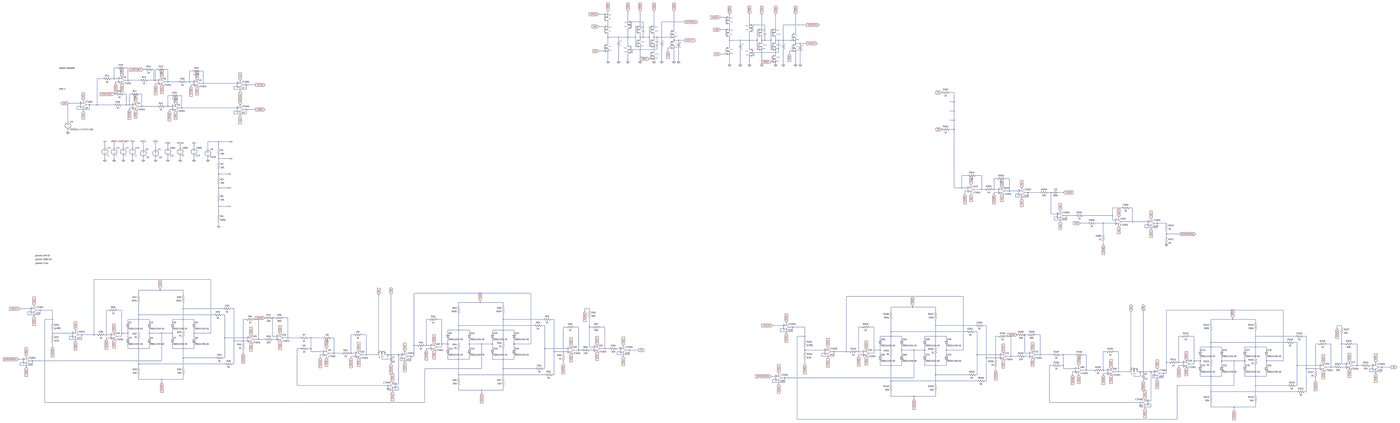
[diagram p0: schematic OZ_8_bounded_curves.asc, whole sheet]
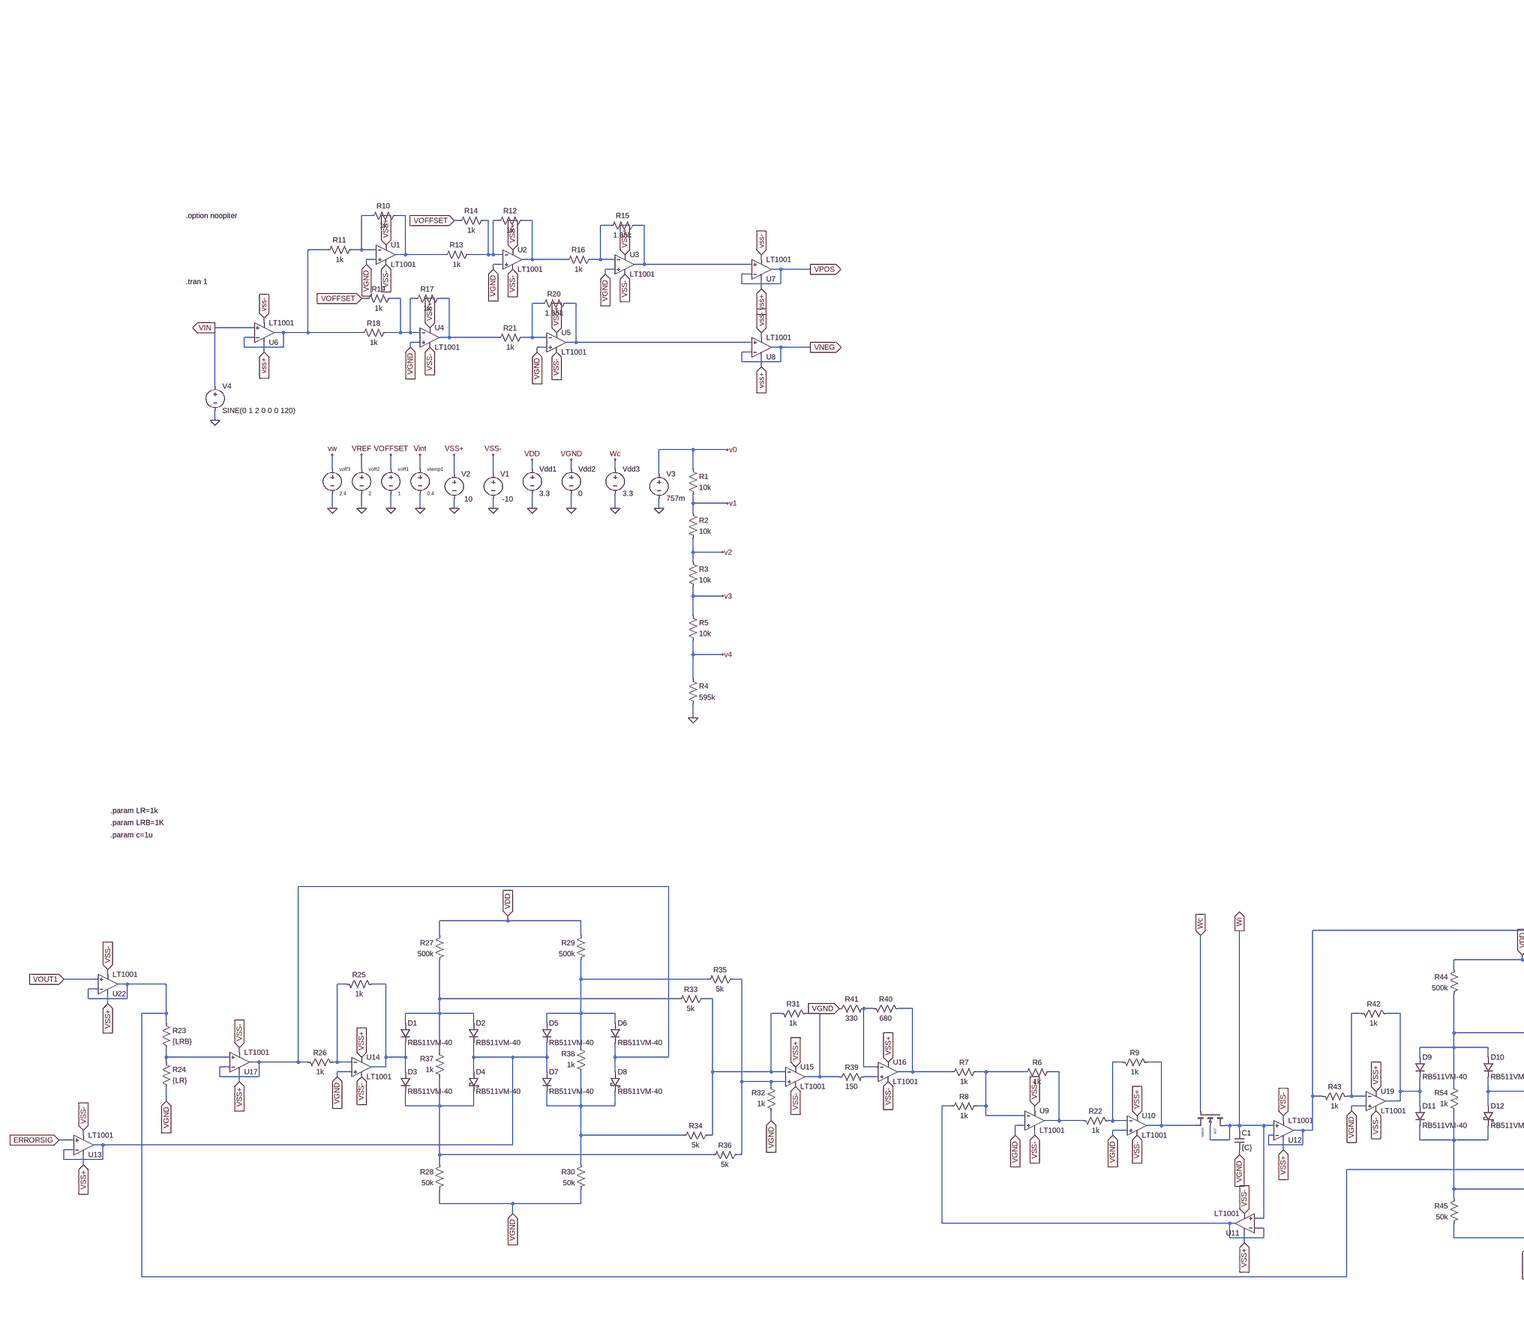
[diagram p1: schematic OZ_8_bounded_curves.asc, part, row 1 of 1, column 1 of 3]
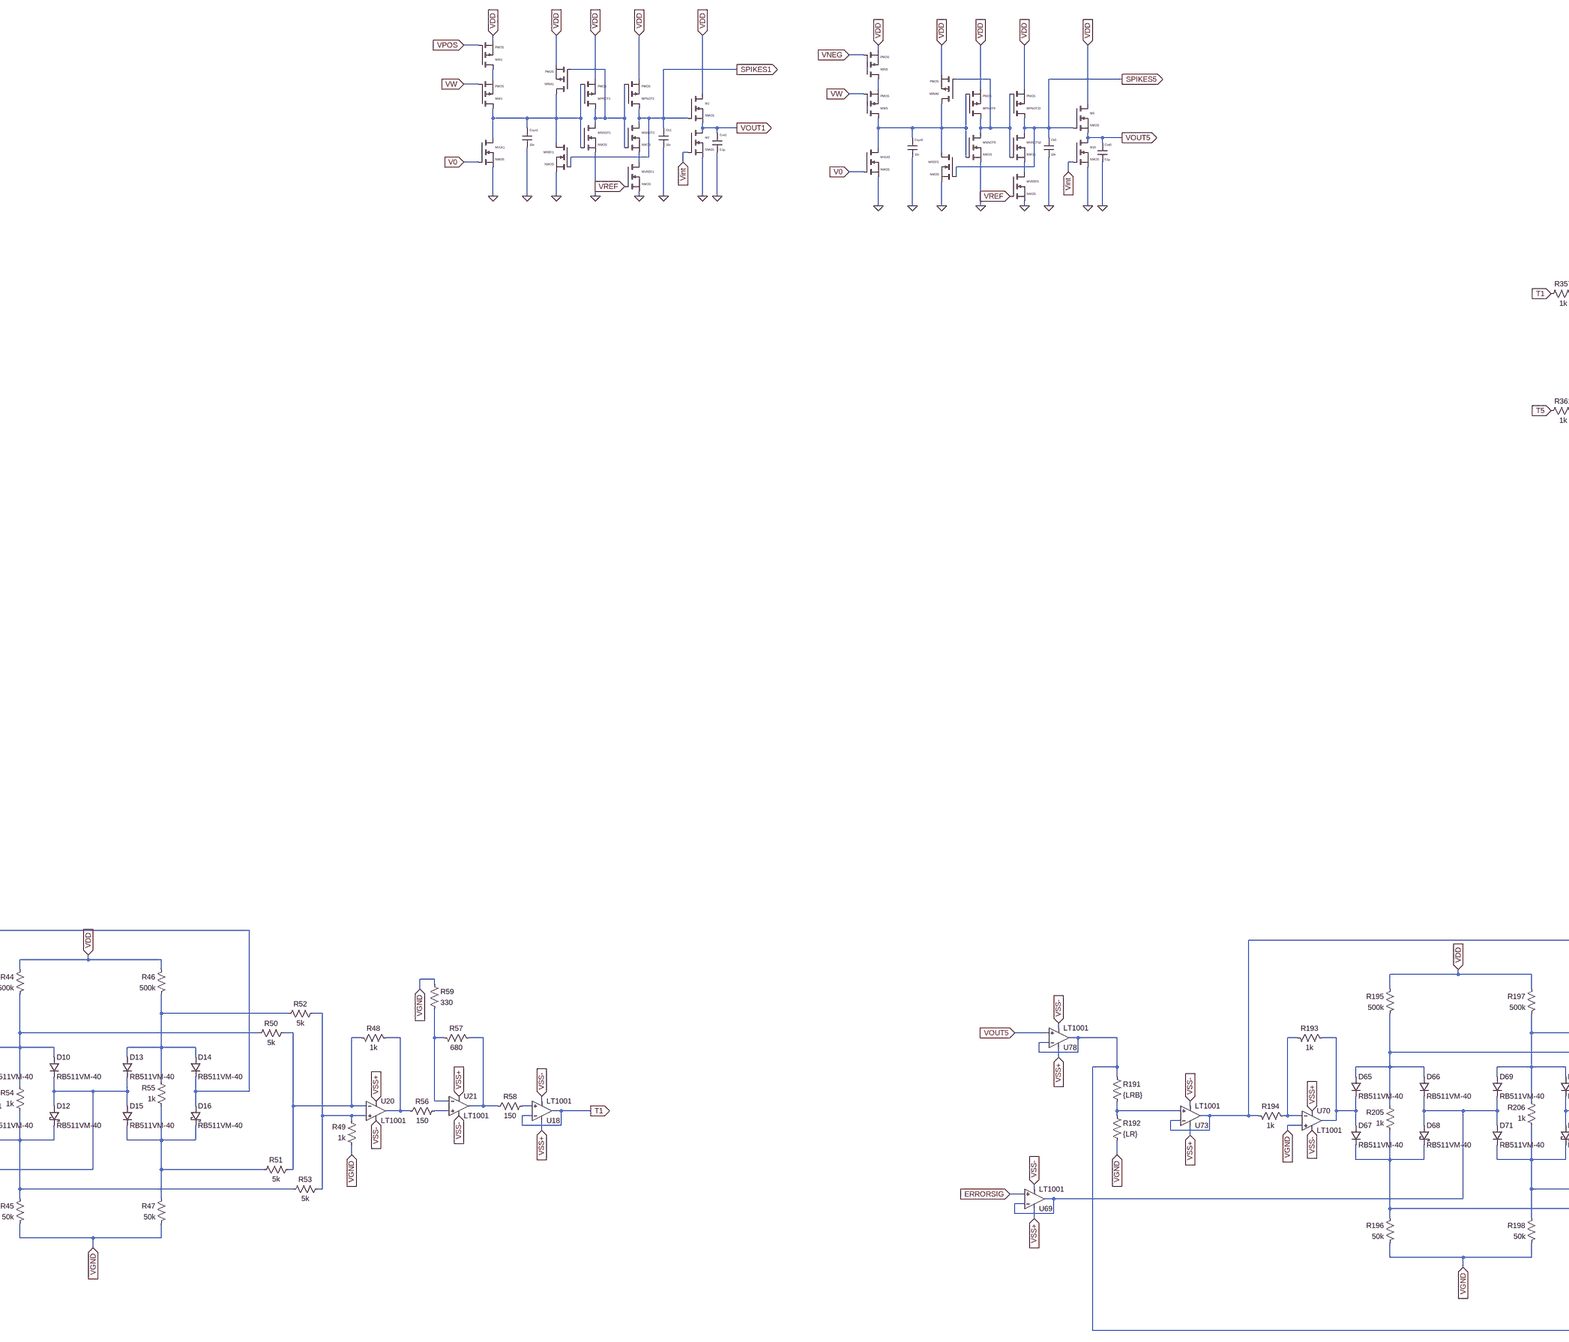
[diagram p2: schematic OZ_8_bounded_curves.asc, part, row 1 of 1, column 2 of 3]
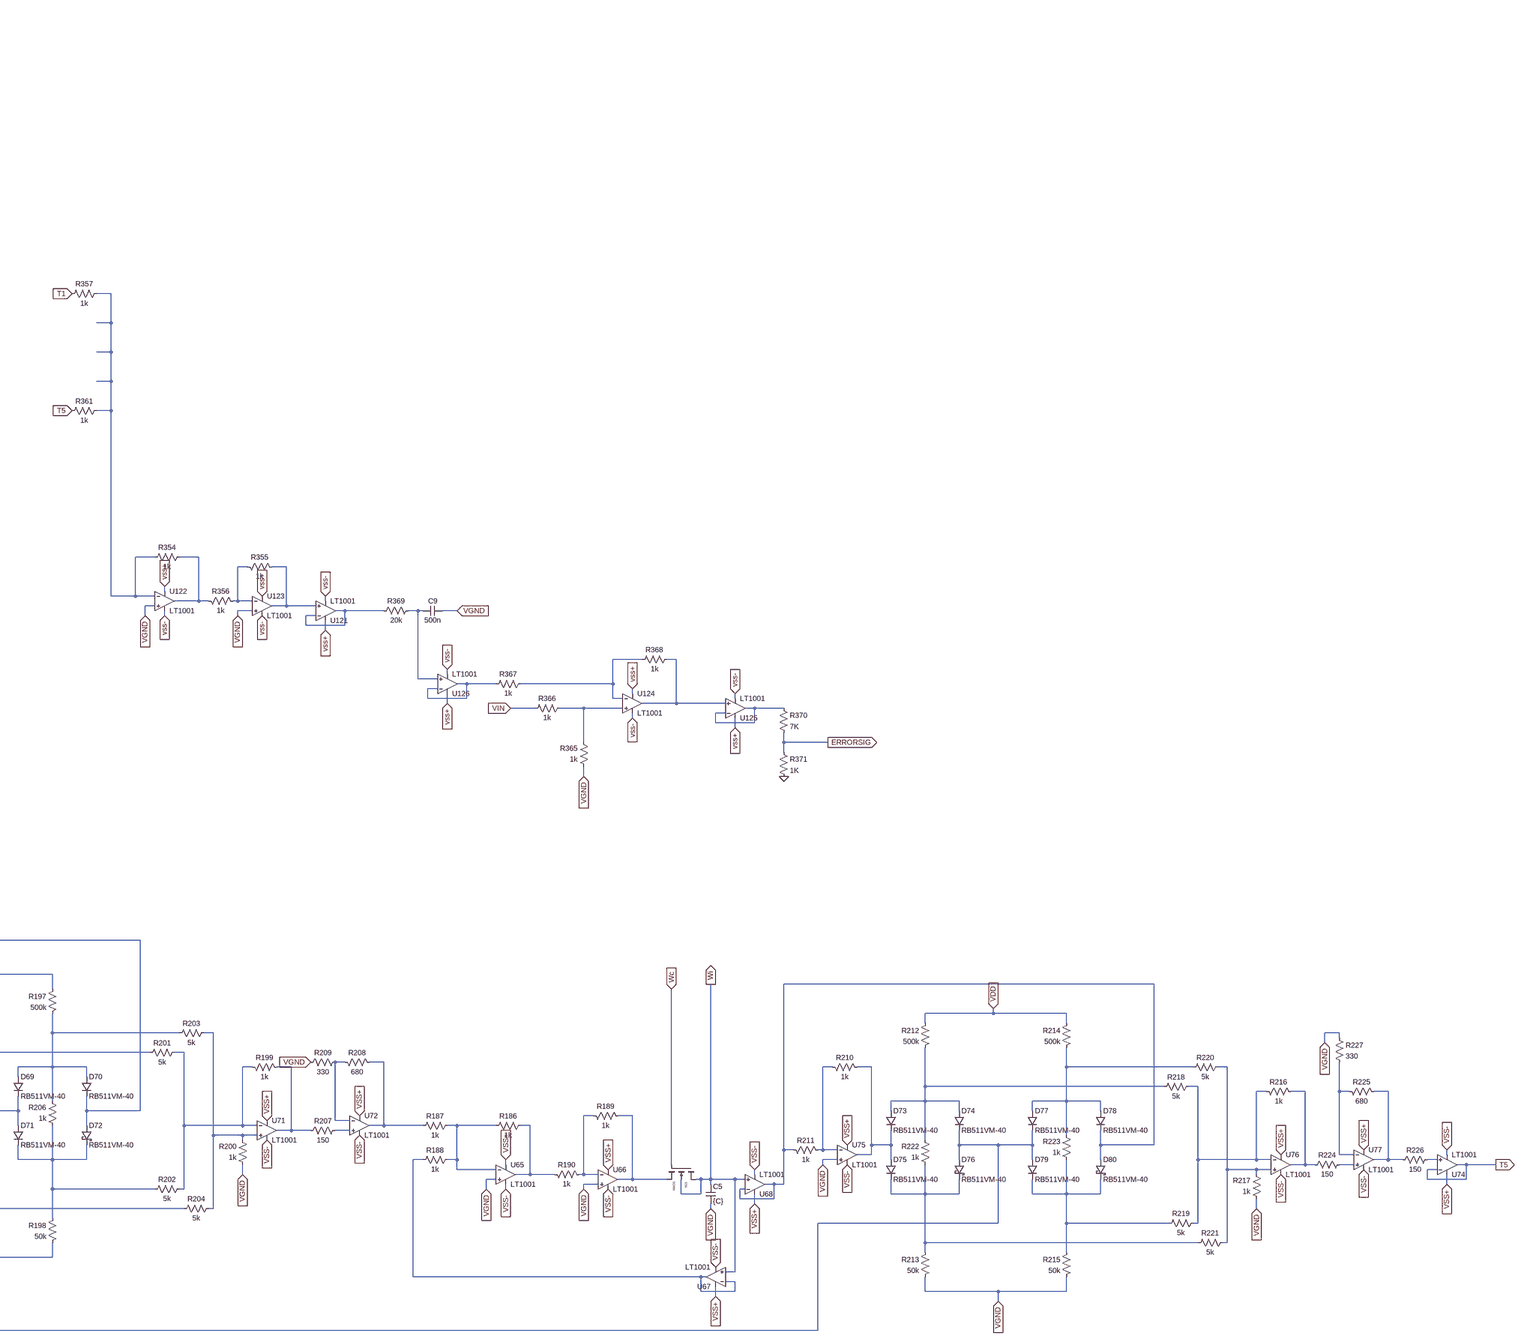
[diagram p3: schematic OZ_8_bounded_curves.asc, part, row 1 of 1, column 3 of 3]
* OZ_8_bounded_curves.asc
vtemp1 Vint 0 0.4
Vdd1 VDD 0 3.3
V1 VSS- 0 -10
V2 VSS+ 0 10
voff1 VOFFSET 0 1
voff2 VREF 0 2
voff3 vw 0 2.4
Vdd2 VGND 0 0
XU1 VGND N009 VSS+ VSS- N010 LT1001  ; pins In+ In- V+ V- OUT
R10 N010 N009 1k
R11 N009 N015 1k
XU2 VGND N011 VSS+ VSS- N012 LT1001  ; pins In+ In- V+ V- OUT
R12 N012 N011 1k
R13 N011 N010 1k
R14 N011 VOFFSET 1k
XU3 VGND N013 VSS+ VSS- N014 LT1001  ; pins In+ In- V+ V- OUT
R15 N014 N013 1.65k
R16 N013 N012 1k
XU4 VGND N017 VSS+ VSS- N018 LT1001  ; pins In+ In- V+ V- OUT
R17 N018 N017 1k
R18 N017 N015 1k
R19 N017 VOFFSET 1k
XU5 VGND N019 VSS+ VSS- N020 LT1001  ; pins In+ In- V+ V- OUT
R20 N020 N019 1.65k
R21 N019 N018 1k
XU6 VIN N015 VSS+ VSS- N015 LT1001  ; pins In+ In- V+ V- OUT
XU7 N014 VPOS VSS+ VSS- VPOS LT1001  ; pins In+ In- V+ V- OUT
XU8 N020 VNEG VSS+ VSS- VNEG LT1001  ; pins In+ In- V+ V- OUT
MW1 N005 vw N002 N002 PMOS
Csyn1 N005 0 10n V=4 Irms=162m Rser=0.395426 Lser=0 mfg="KEMET" pn="C0402C103K7PAC" type="X5R" IC=0
Ck1 SPIKES1 0 10n
MPNOT1 N001 N005 VDD VDD PMOS
MNNOT1 N001 N005 0 0 NMOS
MVREF1 N007 VREF 0 0 NMOS
MREF1 N005 SPIKES1 0 0 NMOS
MVLK1 N005 V0 0 0 NMOS
MINA1 N005 N001 VDD VDD PMOS
MIN1 N002 VPOS VDD VDD PMOS
MPNOT2 SPIKES1 N001 VDD VDD PMOS
MNNOT2 SPIKES1 N001 N007 N007 NMOS
M1 VDD SPIKES1 VOUT1 VOUT1 NMOS
M2 VOUT1 Vint 0 0 NMOS
Cint1 VOUT1 0 0.1µ
MW5 N006 vw N004 N004 PMOS
Csyn5 N006 0 10n V=4 Irms=162m Rser=0.395426 Lser=0 mfg="KEMET" pn="C0402C103K7PAC" type="X5R" IC=0
Ck5 SPIKES5 0 10n
MPNOT9 N003 N006 VDD VDD PMOS
MNNOT9 N003 N006 0 0 NMOS
MVREF5 N008 VREF 0 0 NMOS
MREF5 N006 SPIKES5 0 0 NMOS
MVLK5 N006 V0 0 0 NMOS
MINA5 N006 N003 VDD VDD PMOS
MIN5 N004 VNEG VDD VDD PMOS
MPNOT10 SPIKES5 N003 VDD VDD PMOS
MNNOT10 SPIKES5 N003 N008 N008 NMOS
M9 VDD SPIKES5 VOUT5 VOUT5 NMOS
M10 VOUT5 Vint 0 0 NMOS
Cint5 VOUT5 0 0.1µ
V3 V0 0 757m
R1 V0 v1 10k
R2 v1 v2 10k
R3 v2 v3 10k
R4 v4 0 595k
R5 v3 v4 10k
V4 VIN 0 SINE(0 1 2 0 0 0 120)
XU121 N023 N024 VSS+ VSS- N024 LT1001  ; pins In+ In- V+ V- OUT
XU122 VGND N016 VSS+ VSS- N021 LT1001  ; pins In+ In- V+ V- OUT
R354 N021 N016 1k
XU123 VGND N022 VSS+ VSS- N023 LT1001  ; pins In+ In- V+ V- OUT
R355 N022 N023 1k
R356 N021 N022 1k
R357 N016 T1 1k
R361 N016 T5 1k
M17 Wi Wc N064 Wi NMOS
C1 Wi VGND {C} IC=0
XU9 VGND N072 VSS+ VSS- N073 LT1001  ; pins In+ In- V+ V- OUT
R6 N073 N072 1k
R7 N072 N043 1k
R8 N072 N082 1k
XU10 VGND N063 VSS+ VSS- N064 LT1001  ; pins In+ In- V+ V- OUT
R9 N063 N064 1k
R22 N073 N063 1k
XU11 Wi N082 VSS+ VSS- N082 LT1001  ; pins In+ In- V+ V- OUT
XU12 Wi N032 VSS+ VSS- N032 LT1001  ; pins In+ In- V+ V- OUT
R23 N036 N061 {LRB}
R24 N061 VGND {LR}
XU13 ERRORSIG N062 VSS+ VSS- N062 LT1001  ; pins In+ In- V+ V- OUT
D1 N040 N038 RB511VM-40
XU14 VGND N037 VSS+ VSS- N038 LT1001  ; pins In+ In- V+ V- OUT
R25 N037 N038 1k
R26 N031 N037 1k
D2 N040 N062 RB511VM-40
D3 N038 N080 RB511VM-40
D4 N062 N080 RB511VM-40
R27 VDD N040 500k
R28 N080 VGND 50k
D5 N034 N062 RB511VM-40
D6 N034 N031 RB511VM-40
D7 N062 N081 RB511VM-40
D8 N031 N081 RB511VM-40
R29 VDD N034 500k
R30 N081 VGND 50k
XU15 N035 N041 VSS+ VSS- N044 LT1001  ; pins In+ In- V+ V- OUT
R31 N041 N044 1k
R32 VGND N035 1k
R33 N041 N040 5k
R34 N041 N081 5k
R35 N035 N034 5k
R36 N035 N080 5k
R37 N080 N040 1k
R38 N081 N034 1k
R39 N044 N074 150
XU16 N074 N042 VSS+ VSS- N043 LT1001  ; pins In+ In- V+ V- OUT
R40 N042 N043 680
R41 VGND N042 330
XU17 N061 N031 VSS+ VSS- N031 LT1001  ; pins In+ In- V+ V- OUT
XU18 N083 T1 VSS+ VSS- T1 LT1001  ; pins In+ In- V+ V- OUT
D9 N049 N046 RB511VM-40
XU19 VGND N045 VSS+ VSS- N046 LT1001  ; pins In+ In- V+ V- OUT
R42 N045 N046 1k
R43 N032 N045 1k
D10 N049 N036 RB511VM-40
D11 N046 N092 RB511VM-40
D12 N036 N092 RB511VM-40
R44 VDD N049 500k
R45 N092 VGND 50k
D13 N047 N036 RB511VM-40
D14 N047 N032 RB511VM-40
D15 N036 N093 RB511VM-40
D16 N032 N093 RB511VM-40
R46 VDD N047 500k
R47 N093 VGND 50k
XU20 N048 N050 VSS+ VSS- N053 LT1001  ; pins In+ In- V+ V- OUT
R48 N050 N053 1k
R49 VGND N048 1k
R50 N050 N049 5k
R51 N050 N093 5k
R52 N048 N047 5k
R53 N048 N092 5k
R54 N092 N049 1k
R55 N093 N047 1k
R56 N053 N084 150
XU21 N084 N054 VSS+ VSS- N055 LT1001  ; pins In+ In- V+ V- OUT
R57 N054 N055 680
R58 N055 N083 150
R59 VGND N054 330
XU22 VOUT1 N036 VSS+ VSS- N036 LT1001  ; pins In+ In- V+ V- OUT
M21 Wi Wc N088 Wi NMOS
C5 Wi VGND {C} IC=0
XU65 VGND N089 VSS+ VSS- N090 LT1001  ; pins In+ In- V+ V- OUT
R186 N090 N089 1k
R187 N089 N066 1k
R188 N089 N096 1k
XU66 VGND N087 VSS+ VSS- N088 LT1001  ; pins In+ In- V+ V- OUT
R189 N087 N088 1k
R190 N090 N087 1k
XU67 Wi N096 VSS+ VSS- N096 LT1001  ; pins In+ In- V+ V- OUT
XU68 Wi N039 VSS+ VSS- N039 LT1001  ; pins In+ In- V+ V- OUT
R191 N056 N085 {LRB}
R192 N085 VGND {LR}
XU69 ERRORSIG N086 VSS+ VSS- N086 LT1001  ; pins In+ In- V+ V- OUT
D65 N059 N058 RB511VM-40
XU70 VGND N057 VSS+ VSS- N058 LT1001  ; pins In+ In- V+ V- OUT
R193 N057 N058 1k
R194 N033 N057 1k
D66 N059 N086 RB511VM-40
D67 N058 N094 RB511VM-40
D68 N086 N094 RB511VM-40
R195 VDD N059 500k
R196 N094 VGND 50k
D69 N051 N086 RB511VM-40
D70 N051 N033 RB511VM-40
D71 N086 N095 RB511VM-40
D72 N033 N095 RB511VM-40
R197 VDD N051 500k
R198 N095 VGND 50k
XU71 N052 N060 VSS+ VSS- N067 LT1001  ; pins In+ In- V+ V- OUT
R199 N060 N067 1k
R200 VGND N052 1k
R201 N060 N059 5k
R202 N060 N095 5k
R203 N052 N051 5k
R204 N052 N094 5k
R205 N094 N059 1k
R206 N095 N051 1k
R207 N067 N091 150
XU72 N091 N065 VSS+ VSS- N066 LT1001  ; pins In+ In- V+ V- OUT
R208 N065 N066 680
R209 VGND N065 330
XU73 N085 N033 VSS+ VSS- N033 LT1001  ; pins In+ In- V+ V- OUT
XU74 N097 T5 VSS+ VSS- T5 LT1001  ; pins In+ In- V+ V- OUT
D73 N075 N069 RB511VM-40
XU75 VGND N068 VSS+ VSS- N069 LT1001  ; pins In+ In- V+ V- OUT
R210 N068 N069 1k
R211 N039 N068 1k
D74 N075 N056 RB511VM-40
D75 N069 N099 RB511VM-40
D76 N056 N099 RB511VM-40
R212 VDD N075 500k
R213 N099 VGND 50k
D77 N070 N056 RB511VM-40
D78 N070 N039 RB511VM-40
D79 N056 N100 RB511VM-40
D80 N039 N100 RB511VM-40
R214 VDD N070 500k
R215 N100 VGND 50k
XU76 N071 N076 VSS+ VSS- N077 LT1001  ; pins In+ In- V+ V- OUT
R216 N076 N077 1k
R217 VGND N071 1k
R218 N076 N075 5k
R219 N076 N100 5k
R220 N071 N070 5k
R221 N071 N099 5k
R222 N099 N075 1k
R223 N100 N070 1k
R224 N077 N098 150
XU77 N098 N078 VSS+ VSS- N079 LT1001  ; pins In+ In- V+ V- OUT
R225 N078 N079 680
R226 N079 N097 150
R227 VGND N078 330
XU78 VOUT5 N056 VSS+ VSS- N056 LT1001  ; pins In+ In- V+ V- OUT
XU124 N029 N026 VSS+ VSS- N027 LT1001  ; pins In+ In- V+ V- OUT
R365 VGND N029 1k
R366 N029 VIN 1k
R367 N026 N028 1k
R368 N027 N026 1k
XU125 N027 N030 VSS+ VSS- N030 LT1001  ; pins In+ In- V+ V- OUT
R369 N024 N025 20k
C9 N025 VGND 500n
XU126 N025 N028 VSS+ VSS- N028 LT1001  ; pins In+ In- V+ V- OUT
R370 N030 ERRORSIG 7K
R371 ERRORSIG 0 1K
Vdd3 Wc 0 3.3
.model D D
.lib standard.dio
.model NMOS NMOS
.model PMOS PMOS
.lib standard.mos
.tran 1
.option noopiter
.param LR=1k
.param LRB=1K
.param c=1u
.lib LTC.lib
.backanno
.end